# Altium schematic sheet GD_AirIrDA_Top.SchDoc
size A4
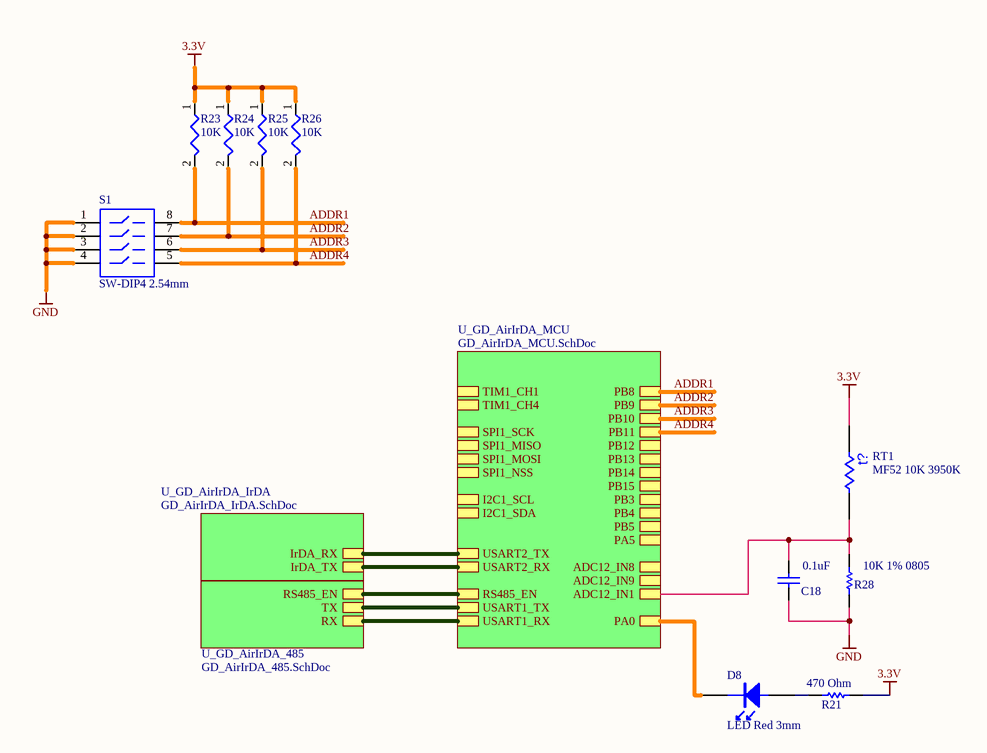
[diagram p0: GD_AirIrDA_Top.SchDoc]

## Parts
C18  value 0.1uF  [CAPC0805(2012)100_N]  (hidden comment: CAP 0.1uF 20% 50V 0805)
D8  LED Red 3mm  [LED_DIP]
R21  value 470 Ohm  [RESC0805(2012)_L]  (hidden comment: 470 Ohm 5% 0805)
R23  value 10K  [R0805]  (hidden comment: 10K 5% 0805)
R24  value 10K  [R0805]  (hidden comment: 10K 5% 0805)
R25  value 10K  [R0805]  (hidden comment: 10K 5% 0805)
R26  value 10K  [R0805]  (hidden comment: 10K 5% 0805)
R28  10K 1% 0805  [RESC0805(2012)_L]
RT1  MF52 10K 3950K  [NTC-MF52]
S1  SW-DIP4 2.54mm  [SW_4P]

## Sub-sheets
U_GD_AirIrDA_485 = GD_AirIrDA_485.SchDoc: RS485_EN, TX, RX
U_GD_AirIrDA_IrDA = GD_AirIrDA_IrDA.SchDoc: IrDA_TX, IrDA_RX
U_GD_AirIrDA_MCU = GD_AirIrDA_MCU.SchDoc: USART1_TX, USART1_RX, USART2_TX, USART2_RX, TIM1_CH1, TIM1_CH4, SPI1_SCK, SPI1_MISO, SPI1_MOSI, SPI1_NSS, I2C1_SCL, I2C1_SDA, ADC12_IN8, ADC12_IN9, ADC12_IN1, RS485_EN, PB8, PB9, PB10, PB11, PB12, PB13, PB14, PB15, PB3, PB4, PB5, PA5, PA0

## Nets
3.3V: R21.2 R23.1 R24.1 R25.1 R26.1 RT1.1
GND: C18.1 R28.2 S1.1 S1.2 S1.3 S1.4
ADDR1: R23.2 S1.8 ; sheet U_GD_AirIrDA_MCU/PB8
ADDR2: R24.2 S1.7 ; sheet U_GD_AirIrDA_MCU/PB9
ADDR3: R25.2 S1.6 ; sheet U_GD_AirIrDA_MCU/PB10
ADDR4: R26.2 S1.5 ; sheet U_GD_AirIrDA_MCU/PB11
NetC18_2: C18.2 R28.1 RT1.2 ; sheet U_GD_AirIrDA_MCU/ADC12_IN1
NetD8_1: D8.1 R21.1
NetD8_2: D8.2 ; sheet U_GD_AirIrDA_MCU/PA0
(unnamed): sheet U_GD_AirIrDA_MCU/USART1_TX, sheet U_GD_AirIrDA_485/TX
(unnamed): sheet U_GD_AirIrDA_MCU/USART1_RX, sheet U_GD_AirIrDA_485/RX
(unnamed): sheet U_GD_AirIrDA_MCU/USART2_TX, sheet U_GD_AirIrDA_IrDA/IrDA_RX
(unnamed): sheet U_GD_AirIrDA_MCU/USART2_RX, sheet U_GD_AirIrDA_IrDA/IrDA_TX
(unnamed): sheet U_GD_AirIrDA_MCU/RS485_EN, sheet U_GD_AirIrDA_485/RS485_EN

## Notes on the sheet
- (in symbol Res Thermal) t?

## Library data of the parts
C18 = CMP-1036-00070-1: CAP 0.1uF 50V ±20% 0805 (2012 Metric) Thickness 1mm SMD; Case-Metric: 2012; Case-EIA: 0805; Tolerance: 20%; Rated Voltage: 50 V; Technology: SMT; Max Thickness: 1 mm
D8 = LED
R21 = CMP-1013-00098-1: 470Ohm 0.125W 5% 0805 (2012 Metric)  SMD; Case-EIA: 0805; Case-Metric: 2012; Power: 0.125 W; Technology: SMT; Tolerance: 5 %
R23-R26 = ER00213: RES THICK_FILM SMD 10K ohm 5% 1/10W ROHS 0603; Manufacturer: YAGEO; Manufacturer P/N: RC0603JR-1310KL; ID: 213; HelpURL: \\192.168.1.3\Esh\Department\RD\CAD\Component\Resistor\SMD\YAGEO_PYu-RC1206_51_RoHS_L_4.pdf; P/N: ER00213
R28 = CMP-1013-00098-1: 10K 0.125W 5% 0805 (2012 Metric)  SMD; Case-EIA: 0805; Case-Metric: 2012; Value: 10000.00 Ohm; Power: 0.125 W; Technology: SMT; Tolerance: 1 %
RT1 = Res Thermal: Thermistor; Published: 24-Mar-1999; LatestRevisionDate: 29-May-2009; LatestRevisionNote: IPC-7351 Footprint Added.; PackageVersion: Mar-2003; PackageReference: 6-0805; Publisher: Altium Limited; PackageDescription: Chip Resistor 0805 Case Size; Code_IPC: RESC2012
S1 = SW-DIP4: 侧拨 4位; Manufacturer: WE; Manufacturer P/N: 418317270904; P/N: EE00004; Published: 24-Mar-1999; LatestRevisionDate: 17-Jul-2002; LatestRevisionNote: Re-released for DXP Platform.; PackageReference: DIP-8; Publisher: Altium Limited